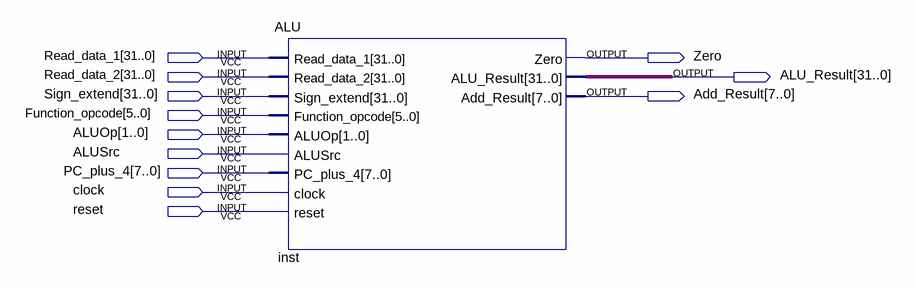
[diagram p0: schematic sheet]
// Quartus schematic ALU_block.bdf as structural Verilog: 1 symbols, 12 pins
module ALU_block (
  input  [31:0] Read_data_1,
  input  [31:0] Read_data_2,
  input  [31:0] Sign_extend,
  input  [5:0] Function_opcode,
  input  [1:0] ALUOp,
  input  ALUSrc,
  input  [7:0] PC_plus_4,
  input  clock,
  input  reset,
  output Zero,
  output [31:0] ALU_Result,
  output [7:0] Add_Result
);

  ALU inst (
    .Read_data_1(Read_data_1), .Read_data_2(Read_data_2), .Sign_extend(Sign_extend),
    .Function_opcode(Function_opcode), .ALUOp(ALUOp), .ALUSrc(ALUSrc), .PC_plus_4(PC_plus_4), .clock(clock),
    .reset(reset), .Zero(Zero), .ALU_Result(ALU_Result), .Add_Result(Add_Result));
endmodule
